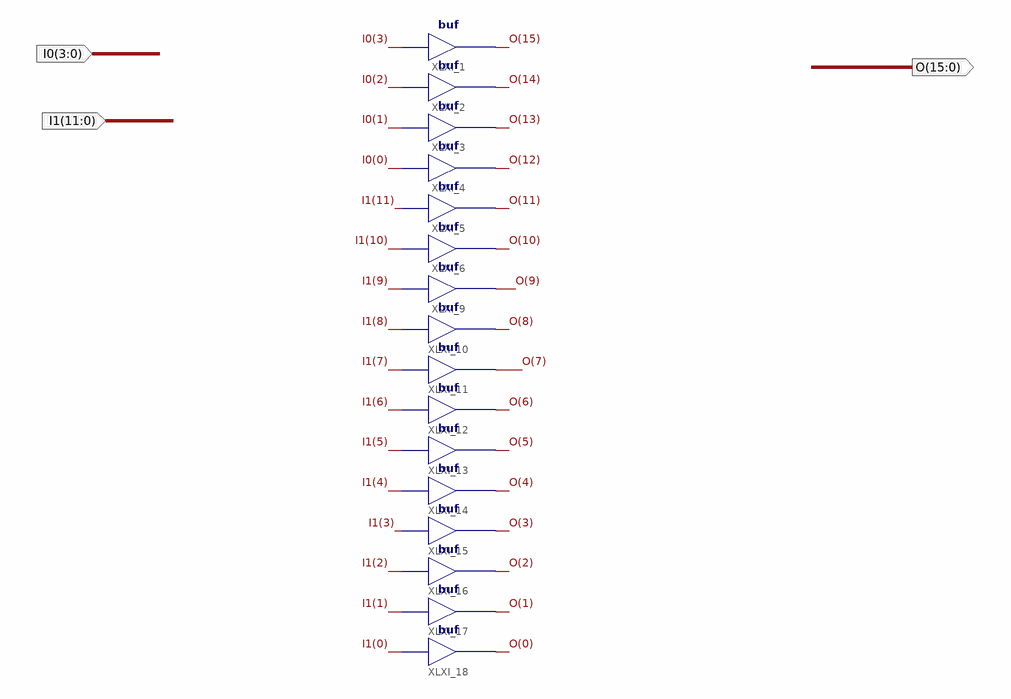
[diagram p0: schematic sheet 1]
// Xilinx ISE schematic buf12_4.sch (spartan3adsp) as structural Verilog: 16 symbols, 3 ports
module buf12_4 (
  input  [3:0] I0,
  input  [11:0] I1,
  output [15:0] O
);

  buf XLXI_1 (O[15], I0[3]);
  buf XLXI_2 (O[14], I0[2]);
  buf XLXI_3 (O[13], I0[1]);
  buf XLXI_4 (O[12], I0[0]);
  buf XLXI_5 (O[11], I1[11]);
  buf XLXI_6 (O[10], I1[10]);
  buf XLXI_9 (O[9], I1[9]);
  buf XLXI_10 (O[8], I1[8]);
  buf XLXI_11 (O[7], I1[7]);
  buf XLXI_12 (O[6], I1[6]);
  buf XLXI_13 (O[5], I1[5]);
  buf XLXI_14 (O[4], I1[4]);
  buf XLXI_15 (O[3], I1[3]);
  buf XLXI_16 (O[2], I1[2]);
  buf XLXI_17 (O[1], I1[1]);
  buf XLXI_18 (O[0], I1[0]);
endmodule
